# EAGLE design southbridge (EAGLE 6.5.0)
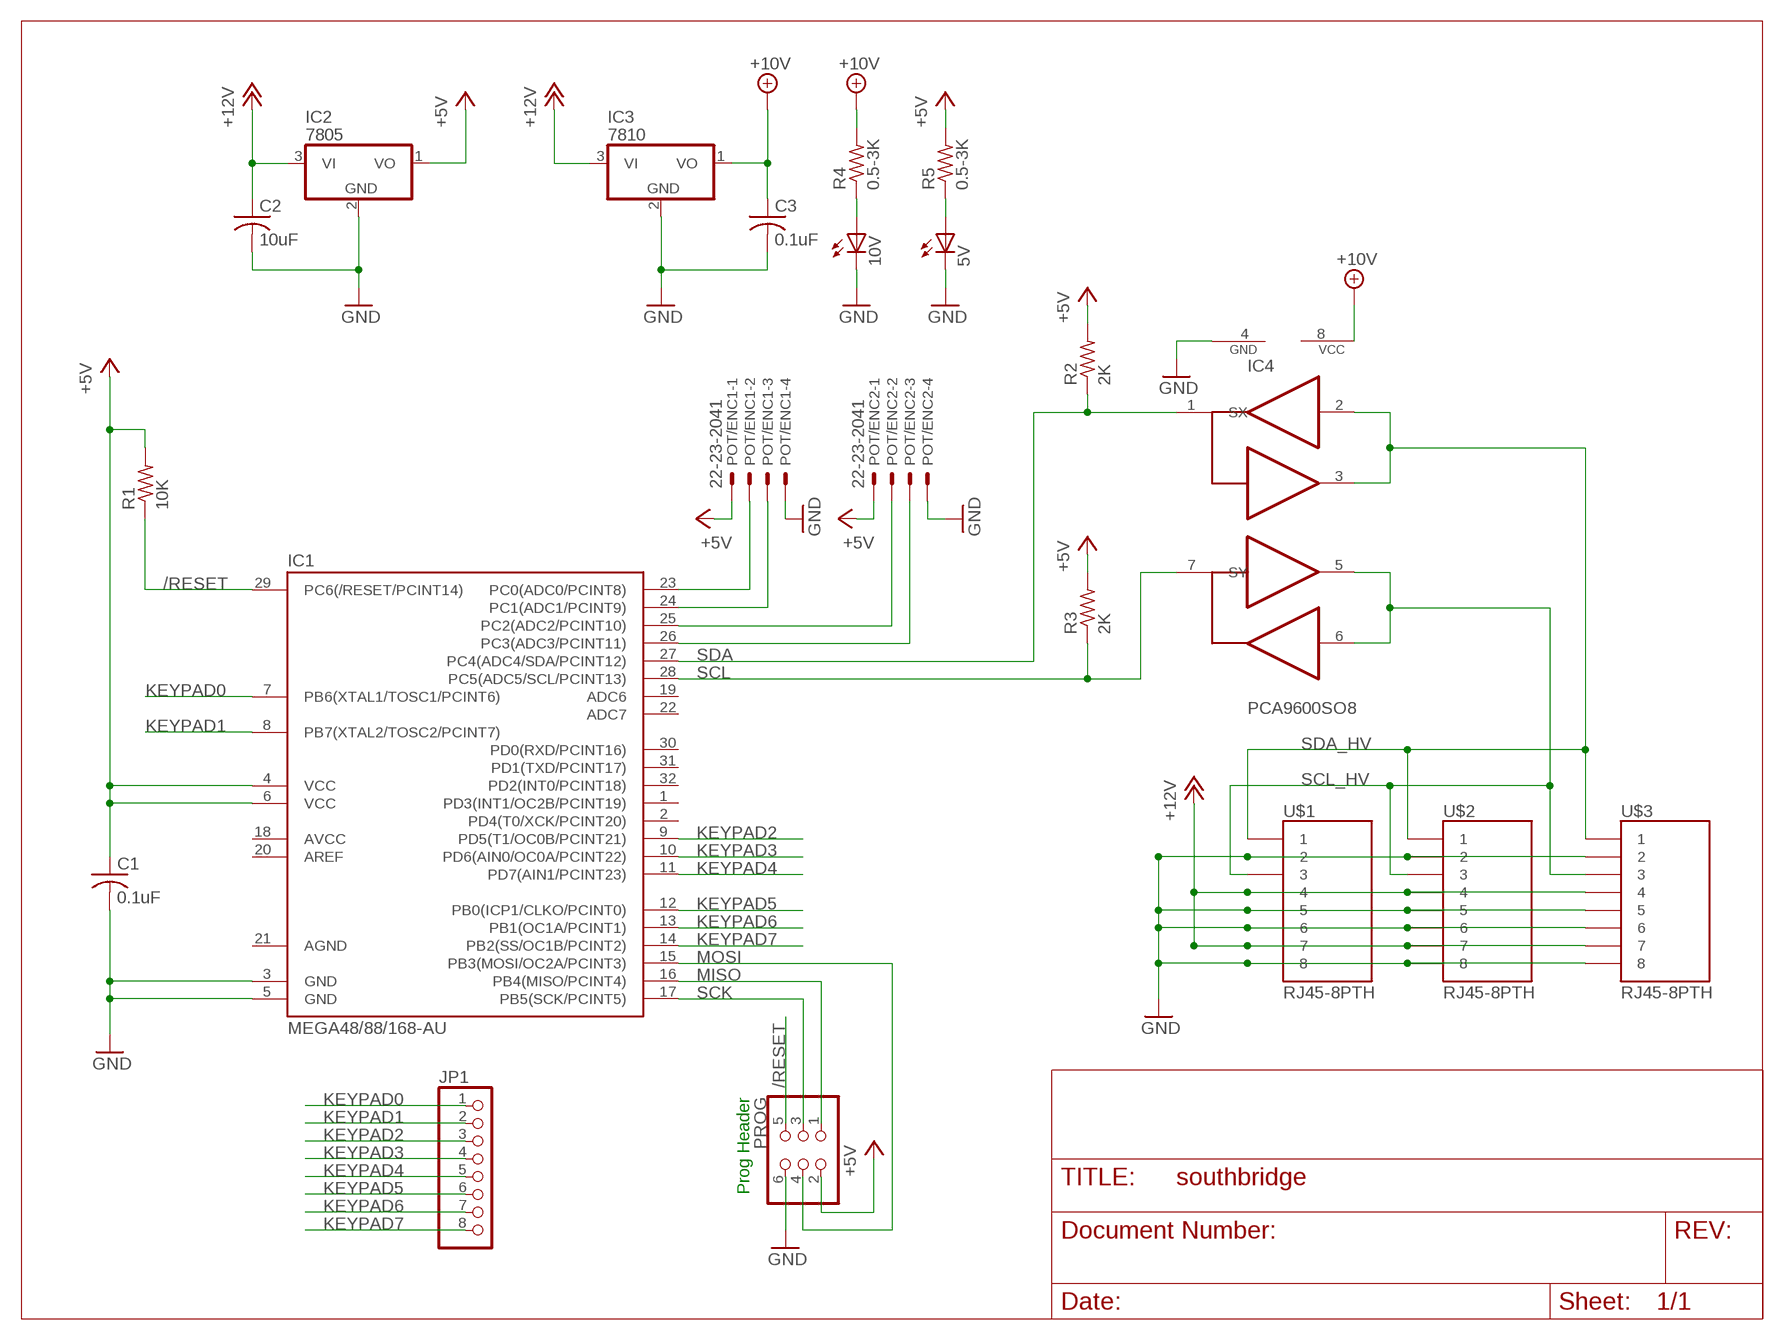
[diagram p0: schematic, sheet 1]

## Parts
5V  LED3MM  [LED3MM]
10V  LED3MM  [LED3MM]
C1  0.1uF  C-US025-025X050  [C025-025X050]
C2  10uF  C-US025-025X050  [C025-025X050]
C3  0.1uF  C-US025-025X050  [C025-025X050]
IC1  MEGA48/88/168-AU  [TQFP32-08]
IC2  7805  78L05Z  [TO92]
IC3  7810  78L05Z  [TO92]
IC4  PCA9600SO8  [SO08]
JP1  HEADER-1X8ROUND  [1X08_ROUND]
POT/ENC1  22-23-2041  [22-23-2041]
POT/ENC2  22-23-2041  [22-23-2041]
PROG  PINHD-2X3  [2X03]
R1  10K  R-US_0204/5  [0204/5]
R2  2K  R-US_0204/5  [0204/5]
R3  2K  R-US_0204/5  [0204/5]
R4  0.5-3K  R-US_0204/5  [0204/5]
R5  0.5-3K  R-US_0204/5  [0204/5]
U$1  RJ45-8PTH  [RJ45-8]
U$2  RJ45-8PTH  [RJ45-8]
U$3  RJ45-8PTH  [RJ45-8]

## Nets
+5V [power]: C1.1 IC1.4(VCC) IC1.6(VCC) IC2.1(VO) POT/ENC1.1 POT/ENC2.1 PROG.2 R1.2 R2.2 R3.2 R5.2
+10V [power]: C3.1 IC3.1(VO) IC4.8(VCC) R4.2
+12V [power]: C2.1 IC2.3(VI) IC3.3(VI) U$1.4 U$1.7 U$2.4 U$2.7 U$3.4 U$3.7
/RESET: IC1.29(PC6(/RESET/PCINT14)) PROG.5 R1.1
GND [power]: 5V.K(C) 10V.K(C) C1.2 C2.2 C3.2 IC1.3(GND) IC1.5(GND) IC2.2(GND) IC3.2(GND) IC4.4(GND) POT/ENC1.4 POT/ENC2.4 PROG.6 U$1.2 U$1.5 U$1.6 U$1.8 U$2.2 U$2.5 U$2.6 U$2.8 U$3.2 U$3.5 U$3.6 U$3.8
KEYPAD0: IC1.7(PB6(XTAL1/TOSC1/PCINT6)) JP1.1
KEYPAD1: IC1.8(PB7(XTAL2/TOSC2/PCINT7)) JP1.2
KEYPAD2: IC1.9(PD5(T1/OC0B/PCINT21)) JP1.3
KEYPAD3: IC1.10(PD6(AIN0/OC0A/PCINT22)) JP1.4
KEYPAD4: IC1.11(PD7(AIN1/PCINT23)) JP1.5
KEYPAD5: IC1.12(PB0(ICP1/CLKO/PCINT0)) JP1.6
KEYPAD6: IC1.13(PB1(OC1A/PCINT1)) JP1.7
KEYPAD7: IC1.14(PB2(SS/OC1B/PCINT2)) JP1.8
MISO: IC1.16(PB4(MISO/PCINT4)) PROG.1
MOSI: IC1.15(PB3(MOSI/OC2A/PCINT3)) PROG.4
N$1: 5V.A R5.1
N$2: 10V.A R4.1
N$3: IC1.23(PC0(ADC0/PCINT8)) POT/ENC1.2
N$4: IC1.24(PC1(ADC1/PCINT9)) POT/ENC1.3
N$5: IC1.25(PC2(ADC2/PCINT10)) POT/ENC2.2
N$6: IC1.26(PC3(ADC3/PCINT11)) POT/ENC2.3
SCK: IC1.17(PB5(SCK/PCINT5)) PROG.3
SCL: IC1.28(PC5(ADC5/SCL/PCINT13)) IC4.7(SY) R3.1
SCL_HV: IC4.5(TY) IC4.6(RY) U$1.3 U$2.3 U$3.3
SDA: IC1.27(PC4(ADC4/SDA/PCINT12)) IC4.1(SX) R2.1
SDA_HV: IC4.2(RX) IC4.3(TX) U$1.1 U$2.1 U$3.1
Unconnected: IC1.1(PD3(INT1/OC2B/PCINT19)) IC1.2(PD4(T0/XCK/PCINT20)) IC1.18(AVCC) IC1.19(ADC6) IC1.20(AREF) IC1.22(ADC7) IC1.30(PD0(RXD/PCINT16)) IC1.31(PD1(TXD/PCINT17)) IC1.32(PD2(INT0/PCINT18))

## Notes on the sheet
- Prog Header

## Power pins joined to a net without a drawn wire
AGND: IC1.21(AGND)

## Library data of the parts
5V 10V = led:LED: LED OSRAM: - CHIPLED LG R971, LG N971, LY N971, LG Q971, LY Q971, LO R971, LY R971 LH N974, LH R974 LS Q976, LO Q976, LY Q976 LO Q996 - Hyper CHIPLED LW Q18S LB Q993, LB Q99A, LB R99A - SideLED LS A670, LO A670, LY A670, LG A670, LP A670 LB A673, LV A673, LT A673, LW A673 LH A674 LY A675 LS A676, LA A676, LO A676, LY A676, LW A676 LS A679, LY A679, LG A679 - Hyper Micro SIDELED® LS Y876, LA Y876, LO Y876, LY Y876 LT Y87S - SmartLED LW L88C, LW L88S LB L89C, LB L89S, LG L890 LS L89K, LO L89K, LY L89K LS L896, LA L896, LO L896, LY L896 - TOPLED LS T670, LO T670, LY T670, LG T670, LP T670 LSG T670, LSP T670, LSY T670, LOP T670, LYG T670 LG T671, LOG T671, LSG T671 LB T673, LV T673, LT T673, LW T673 LH T674 LS T676, LA T676, LO T676, LY T676, LB T676, LH T676, LSB T676, LW T676 LB T67C, LV T67C, LT T67C, LS T67K, LO T67K, LY T67K, LW E67C LS E67B, LA E67B, LO E67B, LY E67B, LB E67C, LV E67C, LT E67C LW T67C LS T679, LY T679, LG T679 LS T770, LO T770, LY T770, LG T770, LP T770 LB T773, LV T773, LT T773, LW T773 LH T774 LS E675, LA E675, LY E675, LS T675 LS T776, LA T776, LO T776, LY T776, LB T776 LHGB T686 LT T68C, LB T68C - Hyper Mini TOPLED® LB M676 - Mini TOPLED Santana® LG M470 LS M47K, LO M47K, LY M47K Source: http://www.osram.convergy.de LUXEON: - LUMILED® LXK2-PW12-R00, LXK2-PW12-S00, LXK2-PW14-U00, LXK2-PW14-V00 LXK2-PM12-R00, LXK2-PM12-S00, LXK2-PM14-U00 LXK2-PE12-Q00, LXK2-PE12-R00, LXK2-PE12-S00, LXK2-PE14-T00, LXK2-PE14-U00 LXK2-PB12-K00, LXK2-PB12-L00, LXK2-PB12-M00, LXK2-PB14-N00, LXK2-PB14-P00, LXK2-PB14-Q00 LXK2-PR12-L00, LXK2-PR12-M00, LXK2-PR14-Q00, LXK2-PR14-R00 LXK2-PD12-Q00, LXK2-PD12-R00, LXK2-PD12-S00 LXK2-PH12-R00, LXK2-PH12-S00 LXK2-PL12-P00, LXK2-PL12-Q00, LXK2-PL12-R00 Source: www.luxeon.com KINGBRIGHT: KA-3528ASYC Source: www.kingbright.com
C1-C3 = rcl:C-US: CAPACITOR, American symbol
IC1 = avr-4:MEGA48/88/168
IC2 IC3 = linear:78*: Positive VOLTAGE REGULATOR Source: http://cache.national.com/ds/LM/LM78L05.pdf http://www.fairchildsemi.com/ds/LM/LM7805.pdf
IC4 = 4534_I2C2:PCA9600: I2C ACTIVE TERMINATOR SO-8
JP1 = microbuilder:HEADER-1X8: PIN HEADER
POT/ENC1 POT/ENC2 = con-molex:22-23-2041: .100" (2.54mm) Center Header - 4 Pin; MF: MOLEX; MPN: 22-23-2041; OC_FARNELL: 1462920; OC_NEWARK: 38C0355
PROG = pinhead:PINHD-2X3: PIN HEADER
R1-R5 = rcl:R-US_: RESISTOR, American symbol
U$1-U$3 = SparkFun:RJ45-8: RJ45 Jack Simple RJ45, 8-pin connection - connector for common Cat5, Cat5e, and Cat6 Ethernet cables. Footprint not yet proven in production. Connector sku is PRT-00643; Breakout PCB sku is BOB-00716.

## Net classes
0 default: width 0.152 mm, drill 0.152 mm, clearance 0.152 mm
1 power: width 0.305 mm, drill 0.305 mm, clearance 0.152 mm to class 0, clearance 0.152 mm

## Board
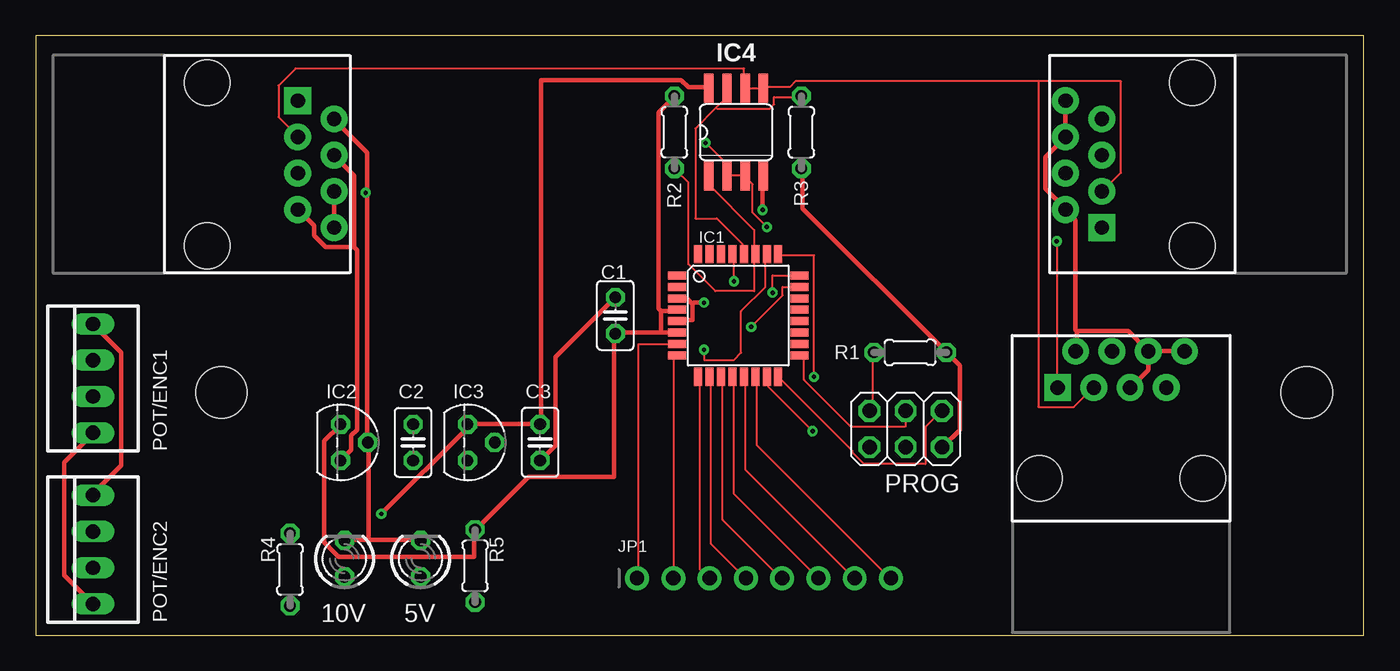
[diagram p1: board, top side]
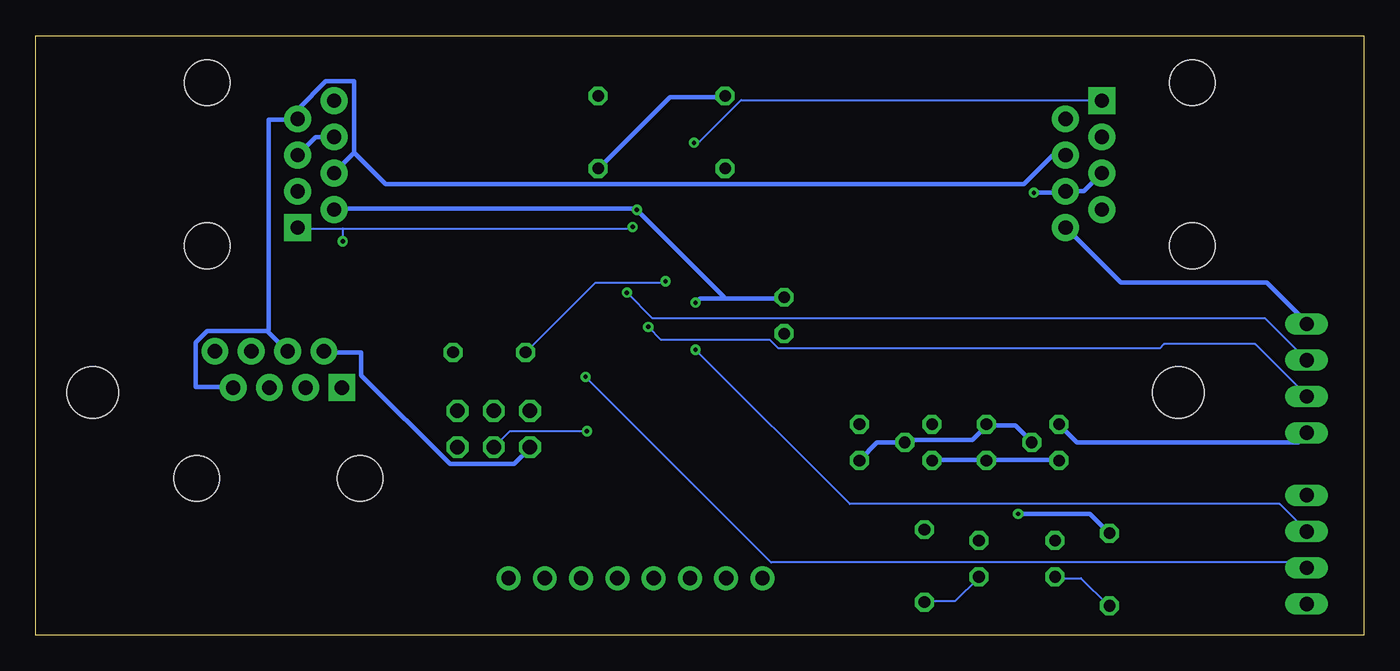
[diagram p2: board, bottom side, seen from below]

Size 93 x 42 mm. Coordinates in mm from the lower left corner, seen from the top.
Outline: 0,0 93,0 93,42 0,42 0,0
Copper layers (1*16): Top 0.035mm / dielectric 1.5mm / Bottom 0.035mm
Design rules "default *": minimum track width 6mil, minimum drill 12mil, track to track 6mil, track to pad 10mil, pad to pad 8mil, via to via 8mil, smd to smd 6mil, copper to edge 30mil, drill to drill 8mil, minimum pad ring 10mil, minimum via ring 8mil, stop-mask expansion 4mil, vias tented up to drill 13mil, thermal gap 10mil
Holes 3.6 mm at 13,17 89,17
tKeepout: area 86,14 to 92,20
bRestrict: area 10,14 to 16,20

### Footprints (pad centres in the part's own frame; a part is rotated, then mirrored left to right if it is on the bottom)
LED3MM = drill 0.813 octagon: A -1.27,0; K 1.27,0
C025-025X050 = drill 0.813 octagon: 1 -1.27,0; 2 1.27,0
TQFP32-08 = smd 1.27 x 0.559: 1 -4.293,2.8; 2 -4.293,2; 3 -4.293,1.2; 4 -4.293,0.4; 5 -4.293,-0.4; 6 -4.293,-1.2; 7 -4.293,-2; 8 -4.293,-2.8; 17 4.293,-2.8; 18 4.293,-2; 19 4.293,-1.2; 20 4.293,-0.4; 21 4.293,0.4; 22 4.293,1.2; 23 4.293,2; 24 4.293,2.8 | smd 0.559 x 1.27: 9 -2.8,-4.293; 10 -2,-4.293; 11 -1.2,-4.293; 12 -0.4,-4.293; 13 0.4,-4.293; 14 1.2,-4.293; 15 2,-4.293; 16 2.8,-4.293; 25 2.8,4.293; 26 2,4.293; 27 1.2,4.293; 28 0.4,4.293; 29 -0.4,4.293; 30 -1.2,4.293; 31 -2,4.293; 32 -2.8,4.293
TO92 = drill 0.813 octagon: 1 -1.27,0; 2 0,1.905; 3 1.27,0
SO08 = smd 0.66 x 2.032: 1 -1.905,-3.073; 2 -0.635,-3.073; 3 0.635,-3.073; 4 1.905,-3.073; 5 1.905,3.073; 6 0.635,3.073; 7 -0.635,3.073; 8 -1.905,3.073
1X08_ROUND = drill 1 pad 1.676: 1 -8.89,0; 2 -6.35,0; 3 -3.81,0; 4 -1.27,0; 5 1.27,0; 6 3.81,0; 7 6.35,0; 8 8.89,0
22-23-2041 = drill 1 long: 1 -3.81,0; 2 -1.27,0; 3 1.27,0; 4 3.81,0
2X03 = drill 1.016 octagon: 1 -2.54,-1.27; 2 -2.54,1.27; 3 0,-1.27; 4 0,1.27; 5 2.54,-1.27; 6 2.54,1.27
0204/5 = drill 0.813 octagon: 1 -2.54,0; 2 2.54,0
RJ45-8 = drill 1 pad 1.88 square: 1 -4.445,6.35 | drill 1 pad 1.88: 2 -3.175,8.89; 3 -1.905,6.35; 4 -0.635,8.89; 5 0.635,6.35; 6 1.905,8.89; 7 3.175,6.35; 8 4.445,8.89 | hole 3.2: -5.715,0; 5.715,0

### Placement (x,y rotation side)
5V  26.96,5.37 90 top
10V  21.62,5.37 90 top
C1  40.59,22.4 90 top
C2  26.43,13.51 90 top
C3  35.32,13.51 270 top
IC1  49.19,22.4 0 top
IC2  21.35,13.51 270 top
IC3  30.24,13.51 270 top
IC4  49.04,35.24 0 top
JP1  51,4 0 top
POT/ENC1  4,18 90 top
POT/ENC2  4,6 90 top
PROG  60.92,14.45 180 top
R1  61.24,19.81 0 top
R2  44.73,35.24 90 top
R3  53.62,35.24 270 top
R4  17.81,4.6 90 top
R5  30.77,4.86 90 top
U$1  81,33 90 top
U$2  76,11 0 top
U$3  12,33 270 top

### Tracks (layer width: path | path; a pad name or v marks a point on that pad's centre or on a via)
+5V
  Top 0.305: POT/ENC2.1 2,4.2 2,12.1 4,14.1 POT/ENC1.1 | IC1.4 44.8,22.7 43.8,22.7 | IC1.6 44.8,21.2 43.8,21.2 | 43.8,21.2 40.6,21.2 C1.1 40.5,21 40.5,11.1 34.5,11.1 30.8,7.4 R5.2 30.7,7.3 30.7,5.5 21.2,5.5 20.2,6.5 20.2,13.6 21.3,14.7 IC2.1 | 43.8,21.2 43.8,22.7 | PROG.2 63.5,13.2 64.7,14.4 64.7,18.9 63.8,19.8 R1.2 63.7,19.9 53.7,29.9 53.7,32.6 R3.2 | 43.8,22.7 43.6,22.9 43.6,36.6 44.7,37.7 R2.2
  Bottom 0.305: IC2.1 21.3,14.7 20.1,13.5 4.6,13.5 4,14.1 POT/ENC1.1 | R3.2 53.6,32.7 48.6,37.7 44.8,37.7 R2.2
+10V  (via drill 0.3)
  Top 0.305: v24.2,8.5 30.2,14.5 30.2,14.7 IC3.1 30.3,14.8 35.2,14.8 C3.1 35.4,14.8 35.4,38.9 45.2,38.9 45.7,38.4 47.1,38.4 IC4.8
  Bottom 0.305: v24.2,8.5 19.2,8.5 17.9,7.2 R4.2
+12V
  Top 0.305: 22.3,27.2 20.3,27.2 19.5,28 19.5,28.7 18.4,29.8 U$3.7 | 22.3,27.2 22.3,32.2 20.9,33.6 U$3.4 | IC2.3 21.4,12.3 22.1,13 22.1,14 22.5,14.4 22.5,27 22.3,27.2
  Bottom 0.305: 76.8,21.3 75.4,19.9 U$2.4 | 76.8,21.3 81,21.3 81.8,20.5 81.8,17.4 79.2,17.4 U$2.7 | 70.7,33.8 72.1,32.4 U$1.4 | 70.7,33.8 70.7,38.8 72.7,38.8 74.6,36.9 74.6,36.2 U$1.7 74.7,36.1 76.7,36.1 76.7,21.4 76.8,21.3 | IC2.3 21.4,12.3 26.4,12.3 C2.1 26.5,12.3 30.2,12.3 IC3.3 | 70.7,33.8 68.5,31.6 23.8,31.6 21.8,33.6 20.9,33.6 U$3.4
/RESET  (via drill 0.3)
  Top 0.152: v48.9,24.8 48.9,26.5 48.8,26.6 IC1.29 | PROG.5 58.4,15.8 58.6,16 58.6,19.8 R1.1
  Bottom 0.152: v48.9,24.8 49,24.7 53.8,24.7 58.6,19.9 R1.1
GND  (via drill 0.3)
  Top 0.305: U$1.8 72.1,37.4 72.1,35 U$1.6 70.7,33.5 70.7,31.3 72.1,29.9 U$1.2 72.2,29.7 72.8,29.1 72.8,21.4 72.9,21.3 | U$2.5 76.7,17.4 77.9,18.6 77.9,19.8 U$2.6 | U$2.8 80.4,19.9 78,19.9 U$2.6 | 72.9,21.3 76.5,21.3 77.8,20 U$2.6 | 72.9,21.3 72.9,19.9 U$2.2 | 51,32.2 IC4.4 50.9,32.1 v50.9,29.8 | IC1.5 45,22.1 46,22.1 46,23.2 | 46,23.2 45.6,23.6 45,23.6 IC1.3 | v46.8,23.3 46.1,23.3 46,23.2 | POT/ENC2.4 4,9.9 6,11.9 6,19.8 POT/ENC1.4 | U$3.8 20.9,28.6 20.9,31 U$3.6 | 23.3,6.7 26.9,6.7 5V.K | 23.3,6.7 21.7,6.7 10V.K | 23.2,31 23.2,13.6 IC2.2 23.3,13.4 23.3,6.7 | 23.2,31 23.2,33.8 20.9,36.1 U$3.2 | v23.1,31 23.2,31 | C1.2 40.5,23.6 36.4,19.5 36.4,13.3 35.4,12.3 C3.2
  Bottom 0.305: U$1.5 74.6,33.7 73.4,34.9 72.2,34.9 U$1.6 | PROG.6 58.4,13.1 59.5,12 64,12 70.2,18.2 70.2,19.8 72.8,19.8 U$2.2 | v46.8,23.3 46.5,23.6 44.8,23.6 | 44.8,23.6 40.6,23.6 C1.2 | 44.8,23.6 44.8,23.7 v50.9,29.8 51,29.9 72.1,29.9 U$1.2 | U$3.5 18.4,32.3 19.6,31.1 20.8,31.1 U$3.6 21,31 v23.1,31 | C3.2 35.3,12.3 34.1,13.5 32.2,13.5 IC3.2 32,13.5 31.8,13.7 27.4,13.7 26.5,14.6 C2.2 26.4,14.7 24.4,14.7 23.3,13.6 IC2.2 | POT/ENC1.4 4,21.9 6.8,24.7 17,24.7 20.8,28.5 U$3.8
KEYPAD0
  Top 0.152: IC1.7 42.2,20.4 42.2,4 JP1.1
KEYPAD1
  Top 0.152: IC1.8 44.7,19.4 44.7,4 JP1.2
KEYPAD2
  Top 0.152: IC1.9 46.5,18 46.5,4.6 47.1,4 JP1.3
KEYPAD3
  Top 0.152: IC1.10 47.3,18 47.3,6.4 49.7,4 JP1.4
KEYPAD4
  Top 0.152: IC1.11 48.1,18 48.1,8.1 52.2,4 JP1.5
KEYPAD5
  Top 0.152: IC1.12 48.9,18 48.9,9.9 JP1.6
KEYPAD6
  Top 0.152: IC1.13 49.7,18 49.7,11.6 57.3,4 JP1.7
KEYPAD7
  Top 0.152: IC1.14 50.5,18 50.5,13.3 59.8,4 JP1.8
MISO
  Top 0.152: IC1.16 57.2,12.9 57.2,12.8 58,12 62.3,12 62.3,14.6 63.4,15.7 PROG.1
MOSI  (via drill 0.3)
  Top 0.152: v54.4,14.3 51.3,17.4 51.3,18 IC1.15
  Bottom 0.152: v54.4,14.3 59.8,14.3 60.9,13.2 PROG.4
N$1
  Bottom 0.152: 5V.A 27,4 28.6,2.4 30.7,2.4 R5.1
N$2
  Bottom 0.152: R4.1 17.9,2.1 19.8,4 21.6,4 10V.A
N$3  (via drill 0.3)
  Top 0.152: v50.1,21.6 52.3,23.8 52.3,24.4 53.4,24.4 IC1.23
  Bottom 0.152: v50.1,21.6 49.2,20.7 41.6,20.7 41,20.1 14.3,20.1 14,20.4 7.6,20.4 4,16.8 POT/ENC1.2
N$4  (via drill 0.3)
  Top 0.152: v51.6,24 51.6,25.2 53.4,25.2 IC1.24
  Bottom 0.152: v51.6,24 49.8,22.2 6.9,22.2 4,19.3 POT/ENC1.3
N$5  (via drill 0.3)
  Top 0.152: v54.5,18.1 54.5,26.6 52,26.6 IC1.25
  Bottom 0.152: v54.5,18.1 41.5,5.1 4.3,5.1 4,4.8 POT/ENC2.2
N$6  (via drill 0.3)
  Top 0.152: v46.8,20 46.8,19.3 48.9,19.3 49.4,19.8 49.4,22.7 51.1,24.4 51.1,26.6 IC1.26
  Bottom 0.152: v46.8,20 36,9.2 5.9,9.2 4,7.3 POT/ENC2.3
SCK
  Top 0.152: IC1.17 53.8,19.3 53.8,17.9 57.1,14.6 60.9,14.6 60.9,15.7 PROG.3
SCL
  Top 0.152: 47.65,36.95 48.4,37.7 IC4.7 | 47.65,36.95 46.2,35.5 46.2,29.2 47.7,29.2 49.5,27.4 49.5,26.7 IC1.28 | R3.1 53.6,37.7 51.7,37.7 51.7,37.2 51.4,36.9 47.7,36.9 47.65,36.95
SCL_HV
  Top 0.152: 70.2,38.8 76,38.8 76,32.4 74.7,31.1 U$1.3 | 70.2,38.8 53.2,38.8 52.8,38.4 51,38.4 IC4.5 50.9,38.3 49.7,38.3 IC4.6 49.6,38.4 49.6,39.7 18.2,39.7 17,38.5 17,36.3 18.3,35 U$3.3 | 70.2,38.8 70.2,16 72.7,16 74,17.3 U$2.3
SDA
  Top 0.152: IC4.1 47.2,32.1 47.2,31.5 50.3,28.4 50.3,26.7 IC1.27 50.3,26.6 50.3,24.1 47.6,24.1 45.7,26 45.7,31.7 44.8,32.6 R2.1
SDA_HV  (via drill 0.3)
  Top 0.152: v51.2,28.6 50.2,29.6 50.2,31.6 49.7,32.1 IC4.3 49.6,32.2 48.5,32.2 IC4.2 48.4,32.2 48.4,33 v46.9,34.5 | v71.5,27.6 71.5,17.4 U$2.1
  Bottom 0.152: v51.2,28.6 51.3,28.5 71.5,28.5 | 71.5,28.5 74.6,28.5 U$1.1 | v46.9,34.5 46.6,34.5 43.6,37.5 18.4,37.5 U$3.1 | 71.5,28.5 v71.5,27.6

### Text on the board
tDocu: EXPERIMENTAL | RULAV South Bridge / Rev A Jan 2019 | 1